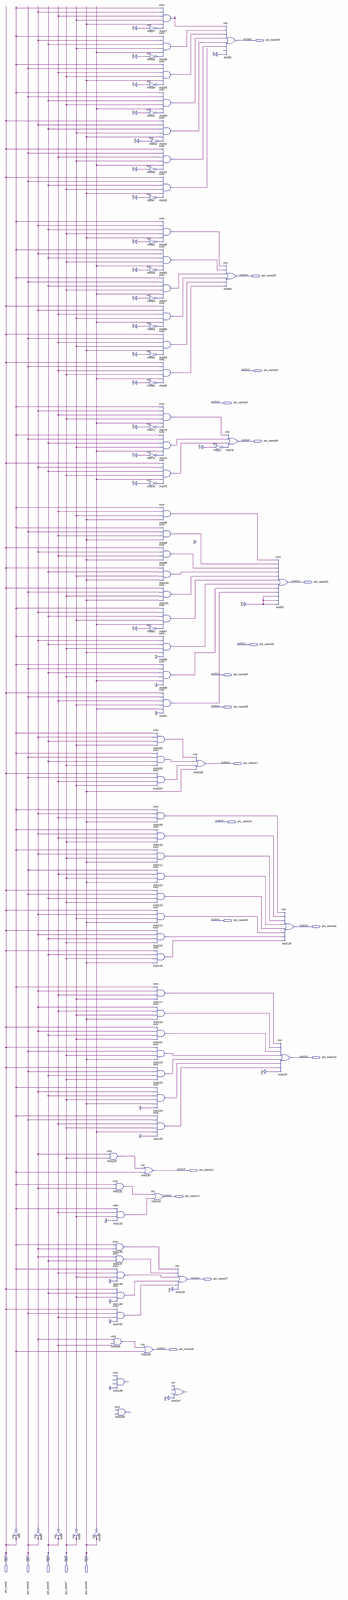
[diagram p0: schematic sheet, whole]
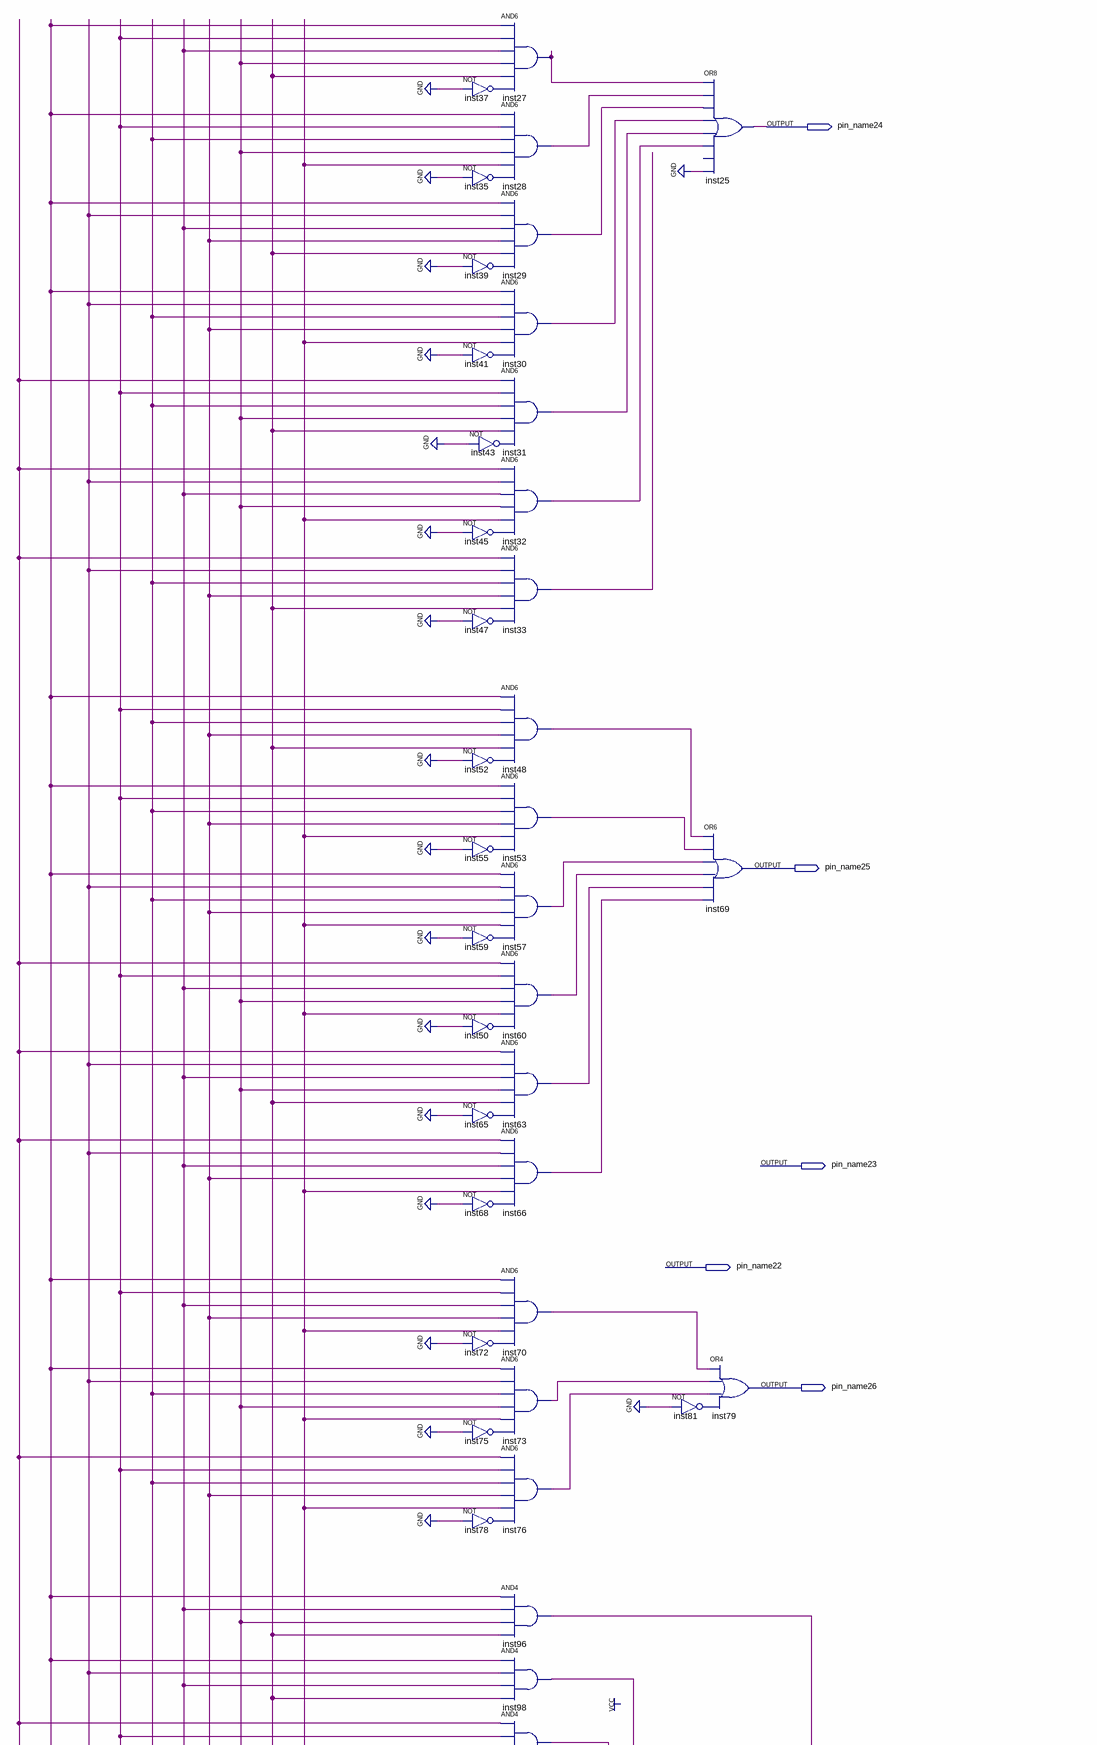
[diagram p1: schematic sheet, upper part]
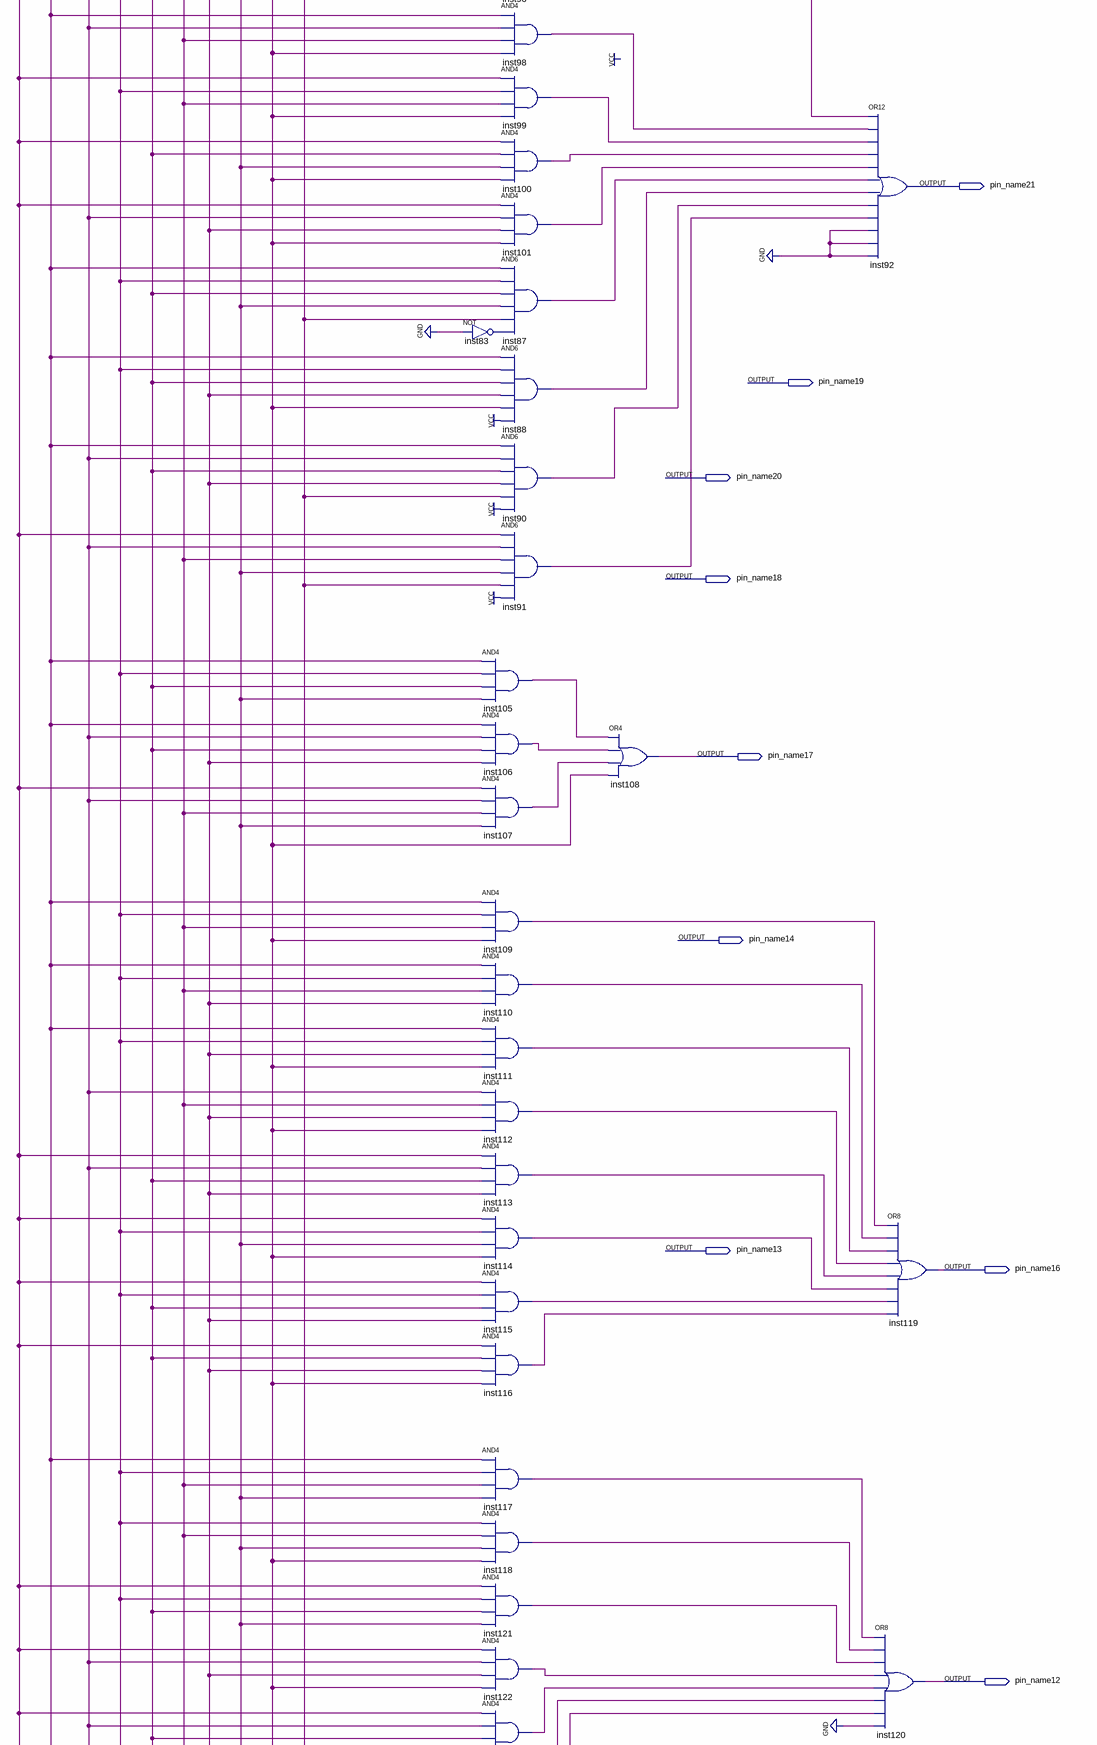
[diagram p2: schematic sheet, middle part]
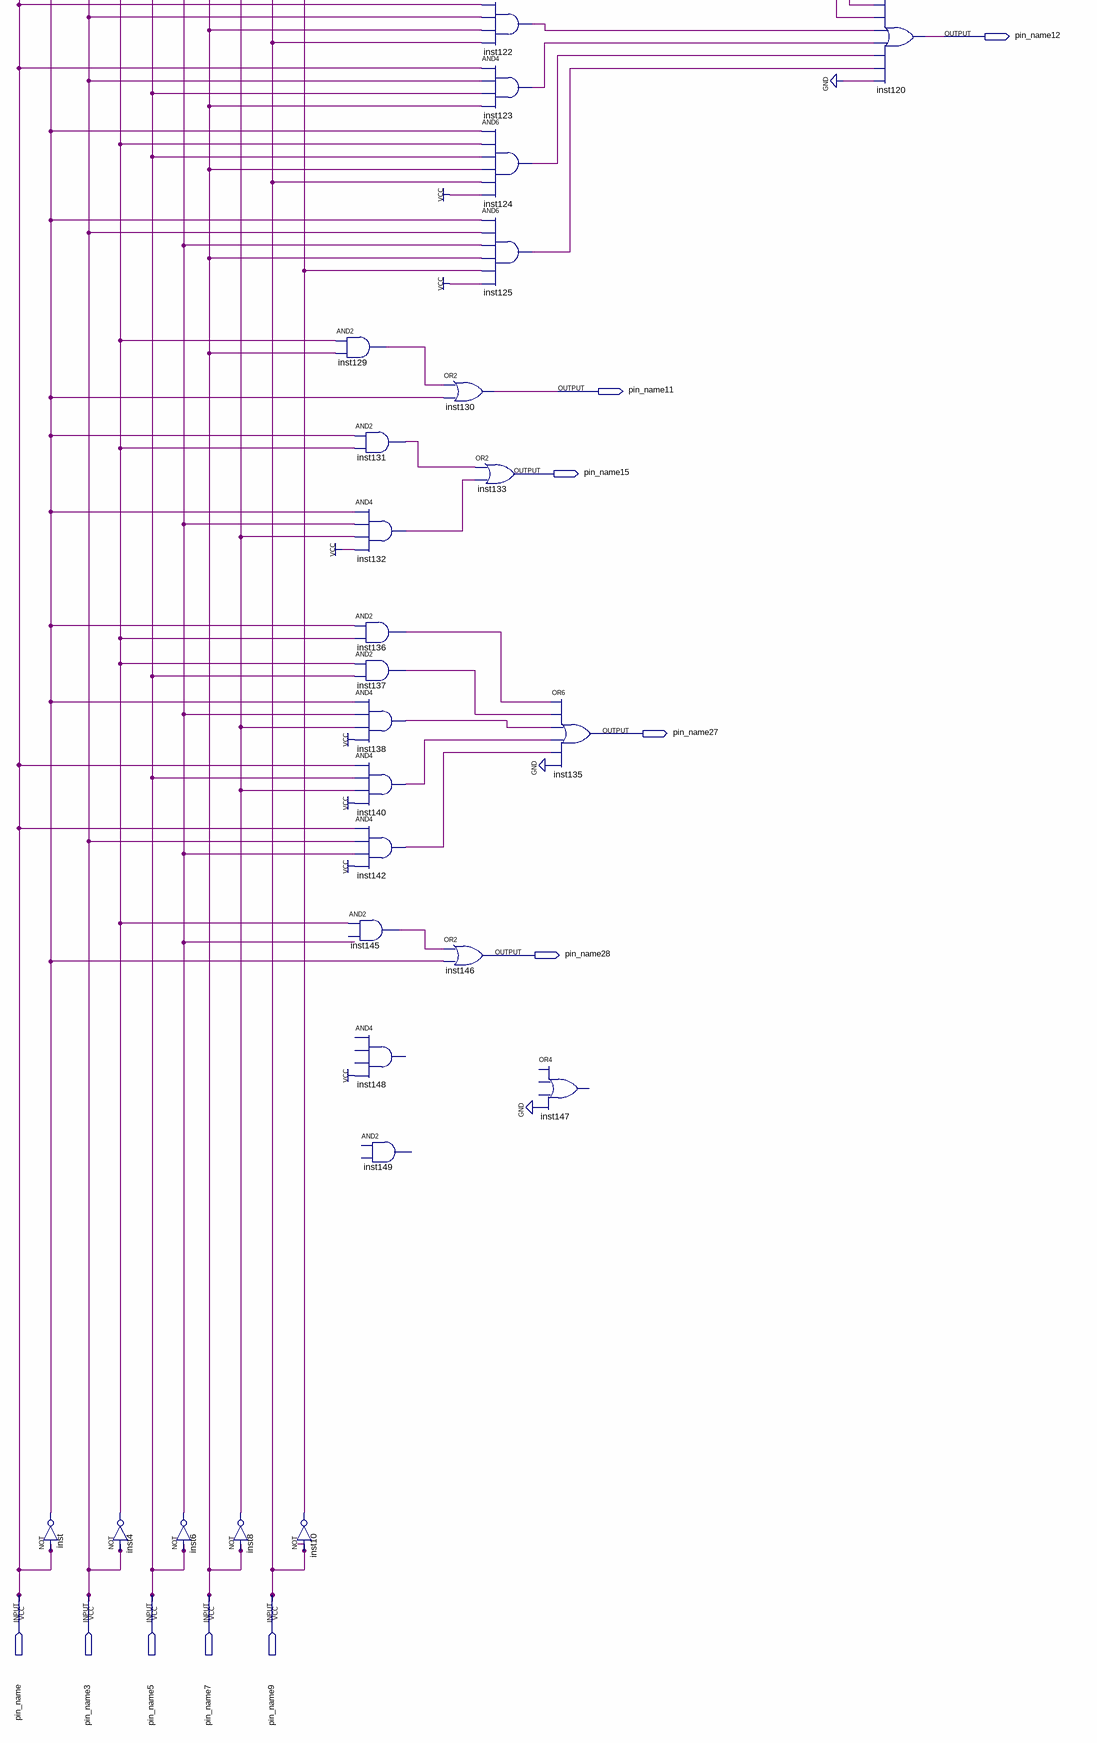
[diagram p3: schematic sheet, lower part]
// Quartus schematic decodnovo.bdf as structural Verilog: 89 symbols, 23 pins
module decodnovo (
  input  pin_name,
  input  pin_name3,
  input  pin_name5,
  input  pin_name7,
  input  pin_name9,
  output pin_name24,
  output pin_name25,
  output pin_name23,
  output pin_name22,
  output pin_name26,
  output pin_name21,
  output pin_name19,
  output pin_name20,
  output pin_name18,
  output pin_name17,
  output pin_name14,
  output pin_name13,
  output pin_name16,
  output pin_name12,
  output pin_name11,
  output pin_name15,
  output pin_name27,
  output pin_name28
);

  wire inst4_out, inst6_out, inst8_out, inst10_out, inst27_out, inst28_out, inst29_out, inst30_out,
       inst31_out, inst32_out, inst33_out, inst35_out, inst37_out, inst39_out, inst41_out, inst45_out,
       inst47_out, inst48_out, inst50_out, inst52_out, inst53_out, inst55_out, inst57_out, inst59_out,
       inst60_out, inst63_out, inst65_out, inst66_out, inst68_out, inst70_out, inst72_out, inst73_out,
       inst75_out, inst76_out, inst78_out, inst81_out, inst83_out, inst87_out, inst88_out, inst90_out,
       inst91_out, inst96_out, inst98_out, inst99_out, inst100_out, inst101_out, inst105_out, inst106_out,
       inst107_out, inst109_out, inst110_out, inst111_out, inst112_out, inst113_out, inst114_out,
       inst115_out, inst116_out, inst117_out, inst118_out, inst121_out, inst122_out, inst123_out,
       inst124_out, inst125_out, inst129_out, inst131_out, inst132_out, inst136_out, inst137_out,
       inst138_out, inst140_out, inst142_out, inst145_out, inst_out;

  not inst (inst_out, pin_name);
  not inst4 (inst4_out, pin_name3);
  not inst6 (inst6_out, pin_name5);
  not inst8 (inst8_out, pin_name7);
  not inst10 (inst10_out, pin_name9);
  and inst129 (inst129_out, inst4_out, pin_name7);
  and inst131 (inst131_out, inst_out, inst4_out);
  and inst132 (inst132_out, inst_out, inst6_out, inst8_out, 1'b1);
  and inst136 (inst136_out, inst_out, inst4_out);
  and inst137 (inst137_out, inst4_out, pin_name5);
  and inst138 (inst138_out, inst_out, inst6_out, inst8_out, 1'b1);
  and inst140 (inst140_out, pin_name, pin_name5, inst8_out, 1'b1);
  and inst142 (inst142_out, pin_name, pin_name3, inst6_out, 1'b1);
  buf inst145 (inst145_out, inst4_out);  // AND2 open: IN2
  // AND4 inst148 has open pins: IN1=open, IN2=open, IN3=open, IN4=1'b1, OUT=open
  // AND2 inst149 is placed but not wired
  not inst37 (inst37_out, 1'b0);
  not inst35 (inst35_out, 1'b0);
  not inst39 (inst39_out, 1'b0);
  not inst41 (inst41_out, 1'b0);
  // NOT inst43 has open pins: IN=1'b0, OUT=open
  not inst45 (inst45_out, 1'b0);
  not inst47 (inst47_out, 1'b0);
  not inst52 (inst52_out, 1'b0);
  not inst55 (inst55_out, 1'b0);
  not inst59 (inst59_out, 1'b0);
  not inst50 (inst50_out, 1'b0);
  not inst65 (inst65_out, 1'b0);
  not inst68 (inst68_out, 1'b0);
  not inst72 (inst72_out, 1'b0);
  not inst75 (inst75_out, 1'b0);
  not inst78 (inst78_out, 1'b0);
  not inst83 (inst83_out, 1'b0);
  or inst130 (pin_name11, inst129_out, inst_out);
  // OR2 inst133 has open pins: IN1=inst131_out, IN2=inst132_out, OUT=open
  or inst146 (pin_name28, inst145_out, inst_out);
  and inst27 (inst27_out, inst_out, inst4_out, inst6_out, inst8_out, pin_name9, inst37_out);
  and inst28 (inst28_out, inst_out, inst4_out, pin_name5, inst8_out, inst10_out, inst35_out);
  and inst29 (inst29_out, inst_out, pin_name3, inst6_out, pin_name7, pin_name9, inst39_out);
  and inst30 (inst30_out, inst_out, pin_name3, pin_name5, pin_name7, inst10_out, inst41_out);
  and inst31 (inst31_out, pin_name, inst4_out, pin_name5, inst8_out, pin_name9);  // open: IN6
  and inst32 (inst32_out, pin_name, pin_name3, inst6_out, inst8_out, inst10_out, inst45_out);
  and inst33 (inst33_out, pin_name, pin_name3, pin_name5, pin_name7, pin_name9, inst47_out);
  and inst48 (inst48_out, inst_out, inst4_out, pin_name5, pin_name7, pin_name9, inst52_out);
  and inst53 (inst53_out, inst_out, inst4_out, pin_name5, pin_name7, inst10_out, inst55_out);
  and inst57 (inst57_out, inst_out, pin_name3, pin_name5, pin_name7, inst10_out, inst59_out);
  and inst60 (inst60_out, pin_name, inst4_out, inst6_out, inst8_out, inst10_out, inst50_out);
  and inst63 (inst63_out, pin_name, pin_name3, inst6_out, inst8_out, pin_name9, inst65_out);
  and inst66 (inst66_out, pin_name, pin_name3, inst6_out, pin_name7, inst10_out, inst68_out);
  and inst70 (inst70_out, inst_out, inst4_out, inst6_out, pin_name7, inst10_out, inst72_out);
  and inst73 (inst73_out, inst_out, pin_name3, pin_name5, inst8_out, inst10_out, inst75_out);
  and inst76 (inst76_out, pin_name, inst4_out, pin_name5, pin_name7, inst10_out, inst78_out);
  and inst96 (inst96_out, inst_out, inst6_out, inst8_out, pin_name9);
  and inst98 (inst98_out, inst_out, pin_name3, inst6_out, pin_name9);
  and inst99 (inst99_out, pin_name, inst4_out, inst6_out, pin_name9);
  and inst100 (inst100_out, pin_name, pin_name5, inst8_out, pin_name9);
  and inst101 (inst101_out, pin_name, pin_name3, pin_name7, pin_name9);
  and inst87 (inst87_out, inst_out, inst4_out, pin_name5, inst8_out, inst10_out, inst83_out);
  and inst88 (inst88_out, inst_out, inst4_out, pin_name5, pin_name7, pin_name9, 1'b1);
  and inst90 (inst90_out, inst_out, pin_name3, pin_name5, pin_name7, inst10_out, 1'b1);
  and inst91 (inst91_out, pin_name, pin_name3, inst6_out, inst8_out, inst10_out, 1'b1);
  and inst105 (inst105_out, inst_out, inst4_out, pin_name5, inst8_out);
  and inst106 (inst106_out, inst_out, pin_name3, pin_name5, pin_name7);
  and inst107 (inst107_out, pin_name, pin_name3, inst6_out, inst8_out);
  and inst109 (inst109_out, inst_out, inst4_out, inst6_out, pin_name9);
  and inst110 (inst110_out, inst_out, inst4_out, inst6_out, pin_name7);
  and inst111 (inst111_out, inst_out, inst4_out, pin_name7, pin_name9);
  and inst112 (inst112_out, pin_name3, inst6_out, pin_name7, pin_name9);
  and inst113 (inst113_out, pin_name, pin_name3, pin_name5, pin_name7);
  and inst114 (inst114_out, pin_name, inst4_out, inst8_out, pin_name9);
  and inst115 (inst115_out, pin_name, inst4_out, pin_name5, pin_name7);
  and inst116 (inst116_out, pin_name, pin_name5, pin_name7, pin_name9);
  and inst117 (inst117_out, inst_out, inst4_out, inst6_out, inst8_out);
  and inst118 (inst118_out, inst4_out, inst6_out, inst8_out, pin_name9);
  and inst121 (inst121_out, pin_name, inst4_out, pin_name5, inst8_out);
  and inst122 (inst122_out, pin_name, pin_name3, pin_name7, pin_name9);
  and inst123 (inst123_out, pin_name, pin_name3, pin_name5, pin_name7);
  and inst124 (inst124_out, inst_out, inst4_out, pin_name5, pin_name7, pin_name9, 1'b1);
  and inst125 (inst125_out, inst_out, pin_name3, inst6_out, pin_name7, inst10_out, 1'b1);
  or inst135 (pin_name27, inst136_out, inst137_out, inst138_out, inst140_out, inst142_out, 1'b0);
  // OR4 inst147 has open pins: IN1=open, IN2=open, IN3=open, IN4=1'b0, OUT=open
  or inst108 (pin_name17, inst105_out, inst106_out, inst107_out, pin_name9);
  not inst81 (inst81_out, 1'b0);
  or inst25 (pin_name24, inst27_out, inst28_out, inst29_out, inst30_out, inst31_out, inst32_out, 1'b0);  // open: IN7
  or inst69 (pin_name25, inst48_out, inst53_out, inst57_out, inst60_out, inst63_out, inst66_out);
  or inst79 (pin_name26, inst70_out, inst73_out, inst76_out, inst81_out);
  or inst92 (pin_name21, inst96_out, inst98_out, inst99_out, inst100_out, inst101_out, inst87_out, inst88_out, inst90_out, inst91_out, 1'b0, 1'b0, 1'b0);
  or inst120 (pin_name12, inst117_out, inst118_out, inst121_out, inst122_out, inst123_out, inst124_out, inst125_out, 1'b0);
  or inst119 (pin_name16, inst109_out, inst110_out, inst111_out, inst112_out, inst113_out, inst114_out, inst115_out, inst116_out);
endmodule
